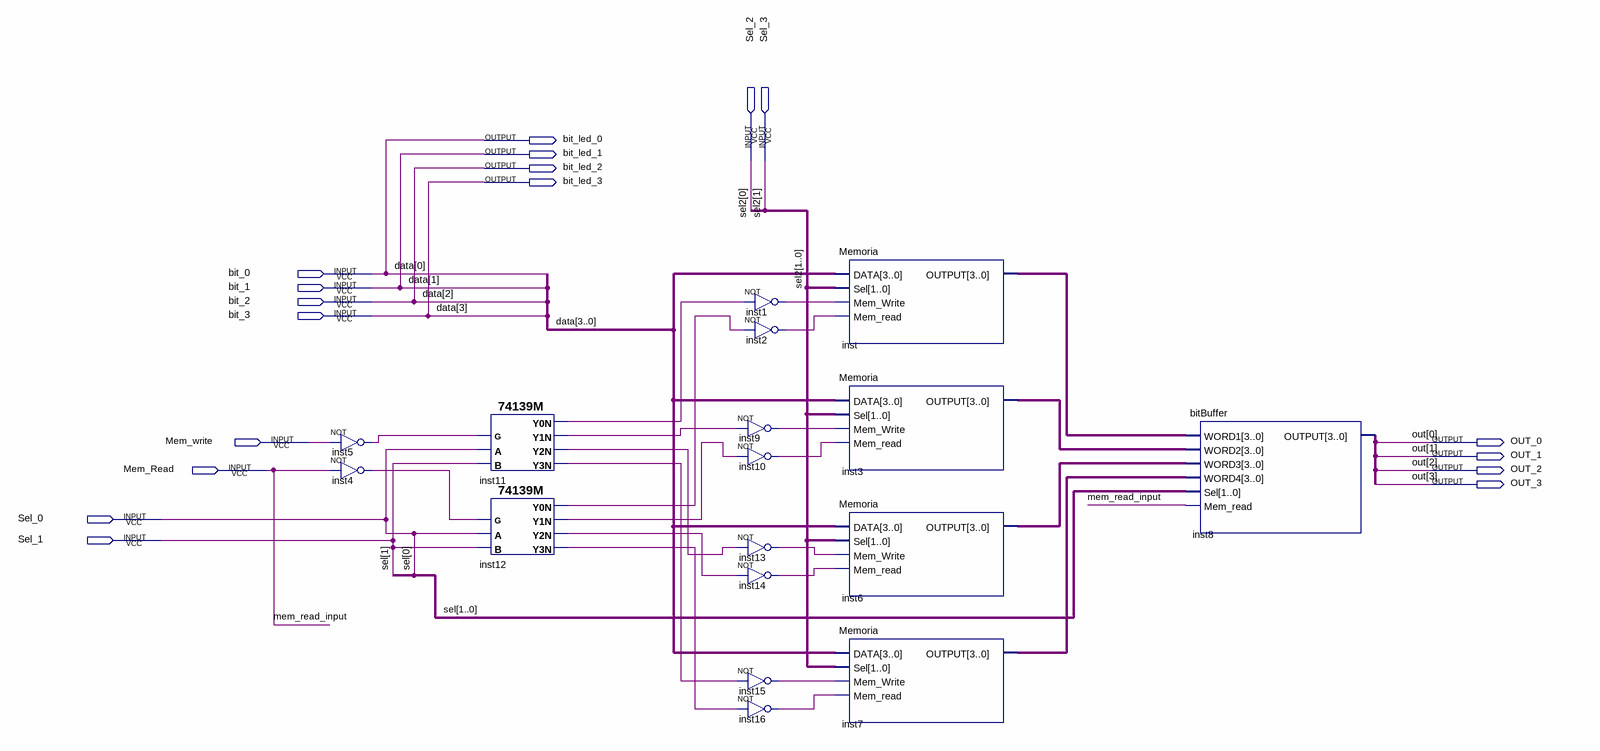
[diagram p0: schematic sheet]
// Quartus schematic mem_4x16.bdf as structural Verilog: 17 symbols, 18 pins
module mem_4x16 (
  input  Sel_2,
  input  Sel_3,
  input  bit_0,
  input  bit_1,
  input  bit_2,
  input  bit_3,
  input  Mem_write,
  input  Mem_Read,
  input  Sel_0,
  input  Sel_1,
  output bit_led_0,
  output bit_led_1,
  output bit_led_2,
  output bit_led_3,
  output OUT_0,
  output OUT_1,
  output OUT_2,
  output OUT_3
);

  wire inst1_out, inst2_out, inst4_out, inst5_out, inst9_out, inst10_out, inst11_y0n, inst11_y1n, inst11_y2n,
       inst11_y3n, inst12_y0n, inst12_y1n, inst12_y2n, inst12_y3n, inst13_out, inst14_out, inst15_out,
       inst16_out;
  wire [3:0] inst3_output, inst6_output, inst7_output, inst8_output, inst_output;

  not inst5 (inst5_out, Mem_write);
  not inst4 (inst4_out, Mem_Read);
  \74139M  inst11 (
    .B(Sel_1), .A(Sel_0), .G(inst5_out), .Y3N(inst11_y3n), .Y2N(inst11_y2n), .Y0N(inst11_y0n),
    .Y1N(inst11_y1n));
  \74139M  inst12 (
    .B(Sel_1), .A(Sel_0), .G(inst4_out), .Y3N(inst12_y3n), .Y2N(inst12_y2n), .Y0N(inst12_y0n),
    .Y1N(inst12_y1n));
  not inst1 (inst1_out, inst11_y0n);
  not inst2 (inst2_out, inst12_y0n);
  not inst9 (inst9_out, inst11_y1n);
  not inst10 (inst10_out, inst12_y1n);
  not inst13 (inst13_out, inst11_y2n);
  not inst14 (inst14_out, inst12_y2n);
  not inst15 (inst15_out, inst11_y3n);
  not inst16 (inst16_out, inst12_y3n);
  Memoria inst (
    .DATA({bit_3, bit_2, bit_1, bit_0}), .Sel({Sel_3, Sel_2}), .Mem_Write(inst1_out), .Mem_read(inst2_out),
    .OUTPUT(inst_output));
  Memoria inst3 (
    .DATA({bit_3, bit_2, bit_1, bit_0}), .Sel({Sel_3, Sel_2}), .Mem_Write(inst9_out), .Mem_read(inst10_out),
    .OUTPUT(inst3_output));
  Memoria inst6 (
    .DATA({bit_3, bit_2, bit_1, bit_0}), .Sel({Sel_3, Sel_2}), .Mem_Write(inst13_out), .Mem_read(inst14_out),
    .OUTPUT(inst6_output));
  Memoria inst7 (
    .DATA({bit_3, bit_2, bit_1, bit_0}), .Sel({Sel_3, Sel_2}), .Mem_Write(inst15_out), .Mem_read(inst16_out),
    .OUTPUT(inst7_output));
  bitBuffer inst8 (
    .WORD1(inst_output), .WORD2(inst3_output), .WORD3(inst6_output), .WORD4(inst7_output),
    .Sel({Sel_1, Sel_0}), .Mem_read(Mem_Read), .OUTPUT(inst8_output));

  assign bit_led_0 = bit_0;
  assign bit_led_1 = bit_1;
  assign bit_led_2 = bit_2;
  assign bit_led_3 = bit_3;

  // Other names for the same wires on the sheet: data[3:0] = {bit_3, bit_2, bit_1, bit_0}; mem_read_input = Mem_Read;
  //   out[3:0] = {OUT_3, OUT_2, OUT_1, OUT_0}; sel[1:0] = {Sel_1, Sel_0}; sel2[1:0] = {Sel_3, Sel_2}
endmodule
